# Altium schematic sheet Sheet1.SchDoc
size A
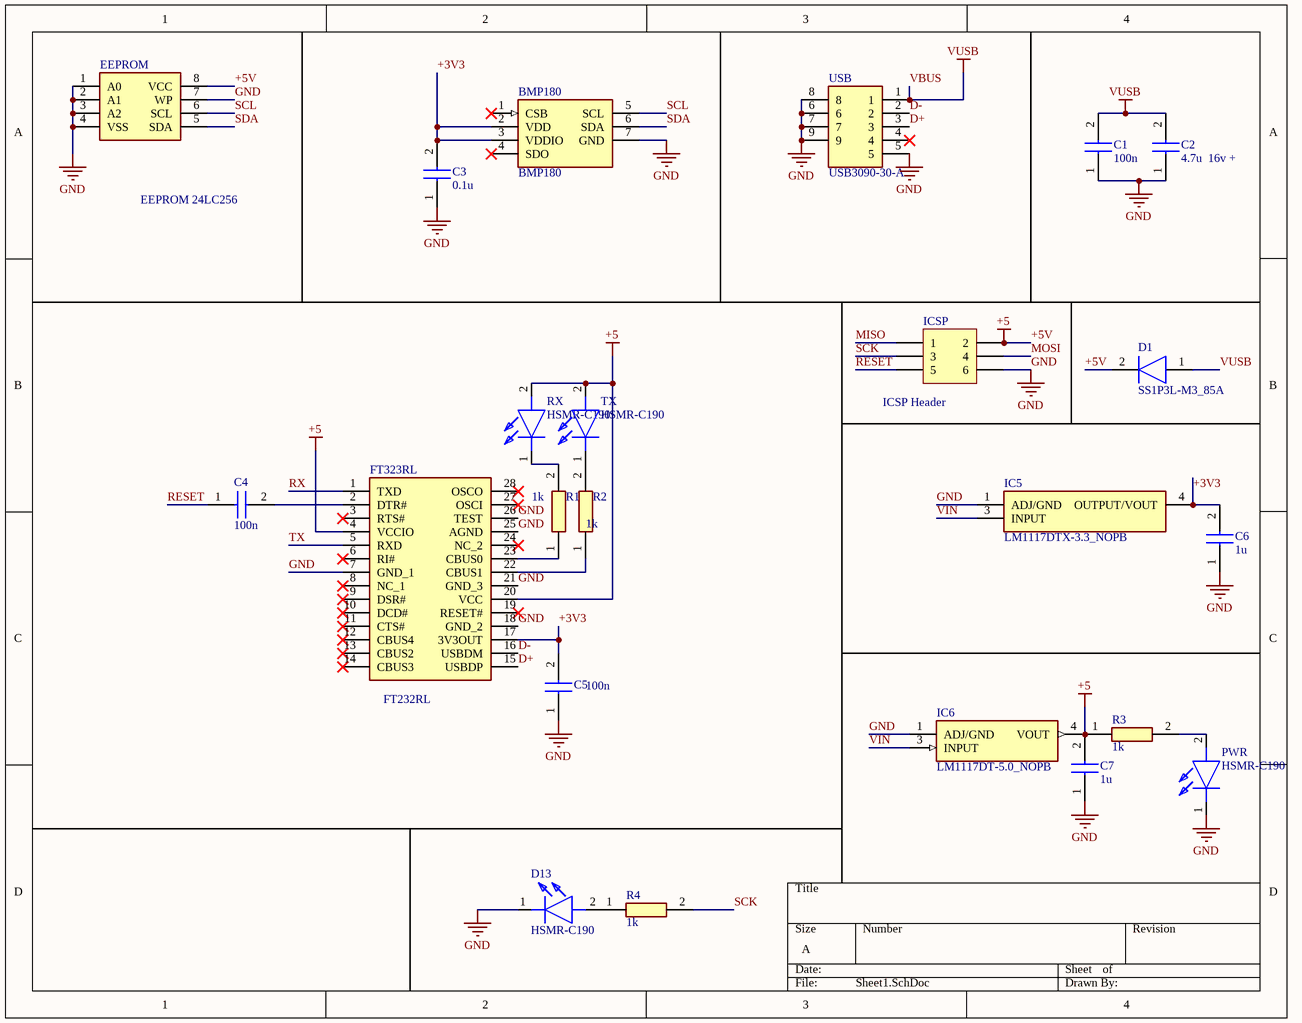
[diagram p0: Sheet1.SchDoc]

## Parts
BMP180  BMP180  [BMP180]
C1  100n  [CAPC1608X87N]
C2  4.7u  16v +  [CAPC1608X87N]
C3  0.1u  [CAPC1608X87N]
C4  100n  [CAPC1608X87N]
C5  100n  [CAPC1608X87N]
C6  1u  [CAPC1608X87N]
C7  1u  [CAPC1608X87N]
D1  SS1P3L-M3_85A  [SMP]
D13  HSMR-C190  [LEDC1608X80N]
EEPROM  EEPROM 24LC256  [SOP65P490X110-8N]
FT323RL  FT232RL  [SOP65P778X200-28N]
IC5  LM1117DTX-3.3_NOPB  [LM1117DTX33NOPB]
IC6  LM1117DT-5.0_NOPB  [TO228P991X238-3N]
ICSP  ICSP Header  [HDR2X3]
PWR  HSMR-C190  [LEDC1608X80N]
R1  1k  [RESC2012X65N]
R2  1k  [RESC2012X65N]
R3  1k  [RESC2012X65N]
R4  1k  [RESC2012X65N]
RX  HSMR-C190  [LEDC1608X80N]
TX  HSMR-C190  [LEDC1608X80N]
USB  USB3090-30-A  [USB309030A]

## Nets
+5V: C7.2 D1.2(K) EEPROM.8(VCC) FT323RL.4(VCCIO) FT323RL.20(VCC) IC6.4(VOUT) ICSP.2 R3.1 RX.2(A) TX.2(A)  [also labelled +5]
GND: BMP180.7(GND) C1.1 C2.1 C3.1 C5.1 C6.1 C7.1 D13.1(K) EEPROM.1(A0) EEPROM.2(A1) EEPROM.3(A2) EEPROM.4(VSS) EEPROM.7(WP) FT323RL.7(GND_1) FT323RL.18(GND_2) FT323RL.21(GND_3) FT323RL.25(AGND) FT323RL.26(TEST) IC5.1(ADJ/GND) IC6.1(ADJ/GND) ICSP.6 PWR.1(K) USB.5 USB.6 USB.7 USB.8 USB.9
VBUS: C1.2 C2.2 D1.1(A) USB.1  [also labelled VUSB]
+3V3: BMP180.2(VDD) BMP180.3(VDDIO) C3.2 C5.2 C6.2 FT323RL.17(3V3OUT) IC5.4(OUTPUT/VOUT)
D+: FT323RL.15(USBDP) USB.3
D-: FT323RL.16(USBDM) USB.2
MISO: ICSP.1
MOSI: ICSP.4
RESET: C4.1 ICSP.5
RX: FT323RL.1(TXD)
SCK: ICSP.3 R4.2
SCL: BMP180.5(SCL) EEPROM.6(SCL)
SDA: BMP180.6(SDA) EEPROM.5(SDA)
TX: FT323RL.5(RXD)
VIN: IC5.3(INPUT) IC6.3(INPUT)
NetC4_2: C4.2 FT323RL.2(DTR#)
NetD13_2: D13.2(A) R4.1
NetFT323RL_22: FT323RL.22(CBUS1) R2.1
NetFT323RL_23: FT323RL.23(CBUS0) R1.1
NetPWR_2: PWR.2(A) R3.2
NetR1_2: R1.2 RX.1(K)
NetR2_2: R2.2 TX.1(K)

Not connected (* = marked no-connect by the designer): BMP180 1(CSB)* 4(SDO)*; FT323RL 3(RTS#)* 6(RI#)* 8(NC_1)* 9(DSR#)* 10(DCD#)* 11(CTS#)* 12(CBUS4)* 13(CBUS2)* 14(CBUS3)* 19(RESET#)* 24(NC_2)* 27(OSCI)* 28(OSCO)*; USB 4*

## Library data of the parts
BMP180 = BMP180: Integrated Circuit; Manufacturer_Name: Bosch Sensortec; Datasheet Link: http://ae-bst.resource.bosch.com/media/products/dokumente/bmp180/BST-BMP180-DS000-12~1.pdf; Manufacturer_Part_Number: BMP180; Mouser Part Number: 262-BMP180; Mouser Price/Stock: https://www.mouser.co.uk/ProductDetail/Bosch-Sensortec/BMP180?qs=d72FGnIDsgTlLIC5YM2WKA%3D%3D
C1-C7 = C0603C569J5GACTU: Capacitor; Manufacturer_Name: Kemet; Datasheet Link: https://content.kemet.com/datasheets/KEM_C1003_C0G_SMD.pdf; Height: 0.87mm; Manufacturer_Part_Number: C0603C569J5GACTU; Arrow Part Number: C0603C569J5GACTU; Arrow Price/Stock: https://www.arrow.com/en/products/c0603c569j5gactu/kemet-corporation
D1 = SS1P3L-M3_85A: Diode; Manufacturer_Name: Vishay; Manufacturer_Part_Number: SS1P3L-M3/85A; Datasheet Link: https://www.vishay.com/docs/88915/ss1p3l.pdf; Mouser Part Number: 625-SS1P3L-M3/85A; Mouser Price/Stock: https://www.mouser.co.uk/ProductDetail/Vishay-General-Semiconductor/SS1P3L-M3-85A?qs=HSPD0Bff7iYLtqq1%2F0B2Eg%3D%3D; Arrow Part Number: SS1P3L-M3/85A; Arrow Price/Stock: https://www.arrow.com/en/products/ss1p3l-m385a/vishay
D13 PWR RX TX = HSMR-C190: LED; Manufacturer_Name: Avago Technologies; Datasheet Link: http://docs-emea.rs-online.com/webdocs/0db8/0900766b80db8877.pdf; Height: 0.8mm; Manufacturer_Part_Number: HSMR-C190; Mouser Part Number: 630-HSMR-C190; Mouser Price/Stock: https://www.mouser.co.uk/ProductDetail/Broadcom-Avago/HSMR-C190?qs=YDL0qNrpDT6vgmbCvO9TGg%3D%3D
EEPROM = 24LC256-I_MS: Integrated Circuit; Manufacturer_Name: Microchip; Manufacturer_Part_Number: 24LC256-I/MS; Datasheet Link: http://componentsearchengine.com/Datasheets/1/24LC256-I_MS.pdf; Height: 1.1mm; Mouser Part Number: 579-24LC256-I/MS; Mouser Price/Stock: https://www.mouser.co.uk/ProductDetail/Microchip-Technology/24LC256-I-MS?qs=XNV0BZVlaZHNGTPuq0J%2FVg%3D%3D; Arrow Part Number: 24LC256-I/MS; Arrow Price/Stock: https://www.arrow.com/en/products/24lc256-ims/microchip-technology
FT323RL = FT232RL-REEL: Integrated Circuit; Manufacturer_Name: FTDI Chip; Datasheet Link: http://www.ftdichip.com/Support/Documents/DataSheets/ICs/DS_FT232R.pdf; Height: 2mm; Manufacturer_Part_Number: FT232RL-REEL; Mouser Part Number: 895-FT232RL; Mouser Price/Stock: https://www.mouser.co.uk/ProductDetail/FTDI/FT232RL-REEL/?qs=D1%2FPMqvA103RC6OU6bKtoA%3D%3D; Arrow Part Number: FT232RL-REEL; Arrow Price/Stock: https://www.arrow.com/en/products/ft232rl-reel/ftdi-chip
IC5 = LM1117DTX-3.3_NOPB: Integrated Circuit; Manufacturer_Name: Texas Instruments; Manufacturer_Part_Number: LM1117DTX-3.3/NOPB; Datasheet Link: http://www.ti.com/lit/gpn/lm1117; Mouser Part Number: 926-LM1117DTX3.3NOPB; Mouser Price/Stock: https://www.mouser.co.uk/ProductDetail/Texas-Instruments/LM1117DTX-33-NOPB?qs=X1J7HmVL2ZFMDtR97FJi7A%3D%3D; Arrow Part Number: LM1117DTX-3.3/NOPB; Arrow Price/Stock: https://www.arrow.com/en/products/lm1117dtx-3.3nopb/texas-instruments
IC6 = LM1117DT-5.0_NOPB: Integrated Circuit; Manufacturer_Name: Texas Instruments; Manufacturer_Part_Number: LM1117DT-5.0/NOPB; Datasheet Link: http://docs-emea.rs-online.com/webdocs/0780/0900766b807800cc.pdf; Height: 2.38mm; Mouser Part Number: 926-LM1117DT50NOPB; Mouser Price/Stock: https://www.mouser.co.uk/ProductDetail/Texas-Instruments/LM1117DT-50-NOPB?qs=X1J7HmVL2ZGITaQRKQ6NVA%3D%3D; Arrow Part Number: LM1117DT-5.0/NOPB; Arrow Price/Stock: https://www.arrow.com/en/products/lm1117dt-5.0nopb/texas-instruments
ICSP = Header 3X2: Header, 3-Pin, Dual row; LatestRevisionDate: 17-Jul-2002; LatestRevisionNote: Re-released for DXP Platform.; Publisher: Altium Limited
R1-R4 = CPF0805B340RE1: Resistor; Manufacturer_Name: TE Connectivity; Datasheet Link: http://docs-europe.electrocomponents.com/webdocs/13d1/0900766b813d116f.pdf; Height: 0.65mm; Manufacturer_Part_Number: CPF0805B340RE1
USB = USB3090-30-A: Connector; Manufacturer_Name: GLOBAL CONNECTOR TECHNOLOGY; Datasheet Link: https://gct.co/files/drawings/usb3090.pdf; Height: 2.7mm; Manufacturer_Part_Number: USB3090-30-A